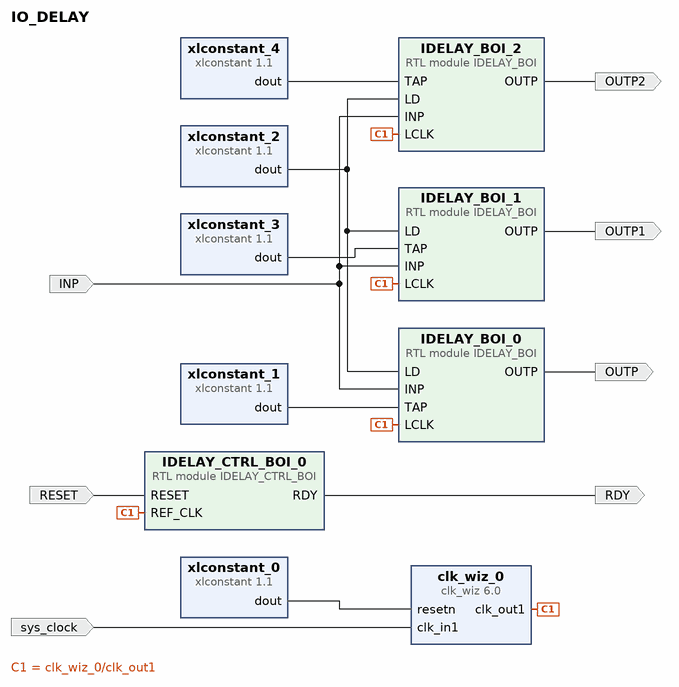
[diagram p0: block diagram of the top level]
# Vivado block design IO_DELAY, xc7z020clg400-1, Vivado 2019.1
create_bd_design IO_DELAY

create_bd_port -dir I INP
create_bd_port -dir O OUTP
create_bd_port -dir I RESET
create_bd_port -dir I -type clk sys_clock
set_property -dict {CONFIG.FREQ_HZ 125000000 CONFIG.PHASE 0.000} [get_bd_ports sys_clock]
create_bd_port -dir O RDY
create_bd_port -dir O OUTP1
create_bd_port -dir O OUTP2

create_bd_cell -type module -reference IDELAY_CTRL_BOI IDELAY_CTRL_BOI_0
create_bd_cell -type ip -vlnv xilinx.com:ip:clk_wiz:6.0 clk_wiz_0
set_property -dict [list \
  CONFIG.CLKOUT1_JITTER 99.414 \
  CONFIG.CLKOUT1_PHASE_ERROR 96.901 \
  CONFIG.CLKOUT1_REQUESTED_OUT_FREQ 310.000 \
  CONFIG.CLK_IN1_BOARD_INTERFACE sys_clock \
  CONFIG.MMCM_CLKFBOUT_MULT_F 7.750 \
  CONFIG.MMCM_CLKOUT0_DIVIDE_F 3.125 \
  CONFIG.RESET_PORT resetn \
  CONFIG.RESET_TYPE ACTIVE_LOW \
  CONFIG.USE_BOARD_FLOW true \
  CONFIG.USE_LOCKED false \
] [get_bd_cells clk_wiz_0]
create_bd_cell -type ip -vlnv xilinx.com:ip:xlconstant:1.1 xlconstant_0
create_bd_cell -type ip -vlnv xilinx.com:ip:xlconstant:1.1 xlconstant_1
set_property -dict {CONFIG.CONST_VAL 0 CONFIG.CONST_WIDTH 5} [get_bd_cells xlconstant_1]
create_bd_cell -type ip -vlnv xilinx.com:ip:xlconstant:1.1 xlconstant_2
create_bd_cell -type ip -vlnv xilinx.com:ip:xlconstant:1.1 xlconstant_3
set_property -dict {CONFIG.CONST_VAL 1 CONFIG.CONST_WIDTH 5} [get_bd_cells xlconstant_3]
create_bd_cell -type ip -vlnv xilinx.com:ip:xlconstant:1.1 xlconstant_4
set_property -dict {CONFIG.CONST_VAL 4 CONFIG.CONST_WIDTH 5} [get_bd_cells xlconstant_4]
create_bd_cell -type module -reference IDELAY_BOI IDELAY_BOI_0
create_bd_cell -type module -reference IDELAY_BOI IDELAY_BOI_1
create_bd_cell -type module -reference IDELAY_BOI IDELAY_BOI_2

# ---- connections ----

connect_bd_net [get_bd_ports INP] [get_bd_pins IDELAY_BOI_0/INP] [get_bd_pins IDELAY_BOI_1/INP] [get_bd_pins IDELAY_BOI_2/INP]
connect_bd_net [get_bd_pins IDELAY_BOI_0/OUTP] [get_bd_ports OUTP]
connect_bd_net [get_bd_ports RESET] [get_bd_pins IDELAY_CTRL_BOI_0/RESET]
connect_bd_net [get_bd_ports sys_clock] [get_bd_pins clk_wiz_0/clk_in1]
connect_bd_net [get_bd_pins clk_wiz_0/clk_out1] \
  [get_bd_pins IDELAY_CTRL_BOI_0/REF_CLK] [get_bd_pins IDELAY_BOI_0/LCLK] [get_bd_pins IDELAY_BOI_1/LCLK] \
  [get_bd_pins IDELAY_BOI_2/LCLK]
connect_bd_net [get_bd_pins xlconstant_0/dout] [get_bd_pins clk_wiz_0/resetn]
connect_bd_net [get_bd_pins IDELAY_CTRL_BOI_0/RDY] [get_bd_ports RDY]
connect_bd_net [get_bd_pins xlconstant_1/dout] [get_bd_pins IDELAY_BOI_0/TAP]
connect_bd_net [get_bd_pins xlconstant_2/dout] [get_bd_pins IDELAY_BOI_0/LD] [get_bd_pins IDELAY_BOI_1/LD] [get_bd_pins IDELAY_BOI_2/LD]
connect_bd_net [get_bd_pins xlconstant_3/dout] [get_bd_pins IDELAY_BOI_1/TAP]
connect_bd_net [get_bd_pins IDELAY_BOI_1/OUTP] [get_bd_ports OUTP1]
connect_bd_net [get_bd_pins IDELAY_BOI_2/OUTP] [get_bd_ports OUTP2]
connect_bd_net [get_bd_pins xlconstant_4/dout] [get_bd_pins IDELAY_BOI_2/TAP]

validate_bd_design
save_bd_design
